# EasyEDA schematic plataforma sensores.json
TITLE: Sheet_1; REV: 1.0; Date: 2023-09-05; Sheet: 1/1; Company: Your Company
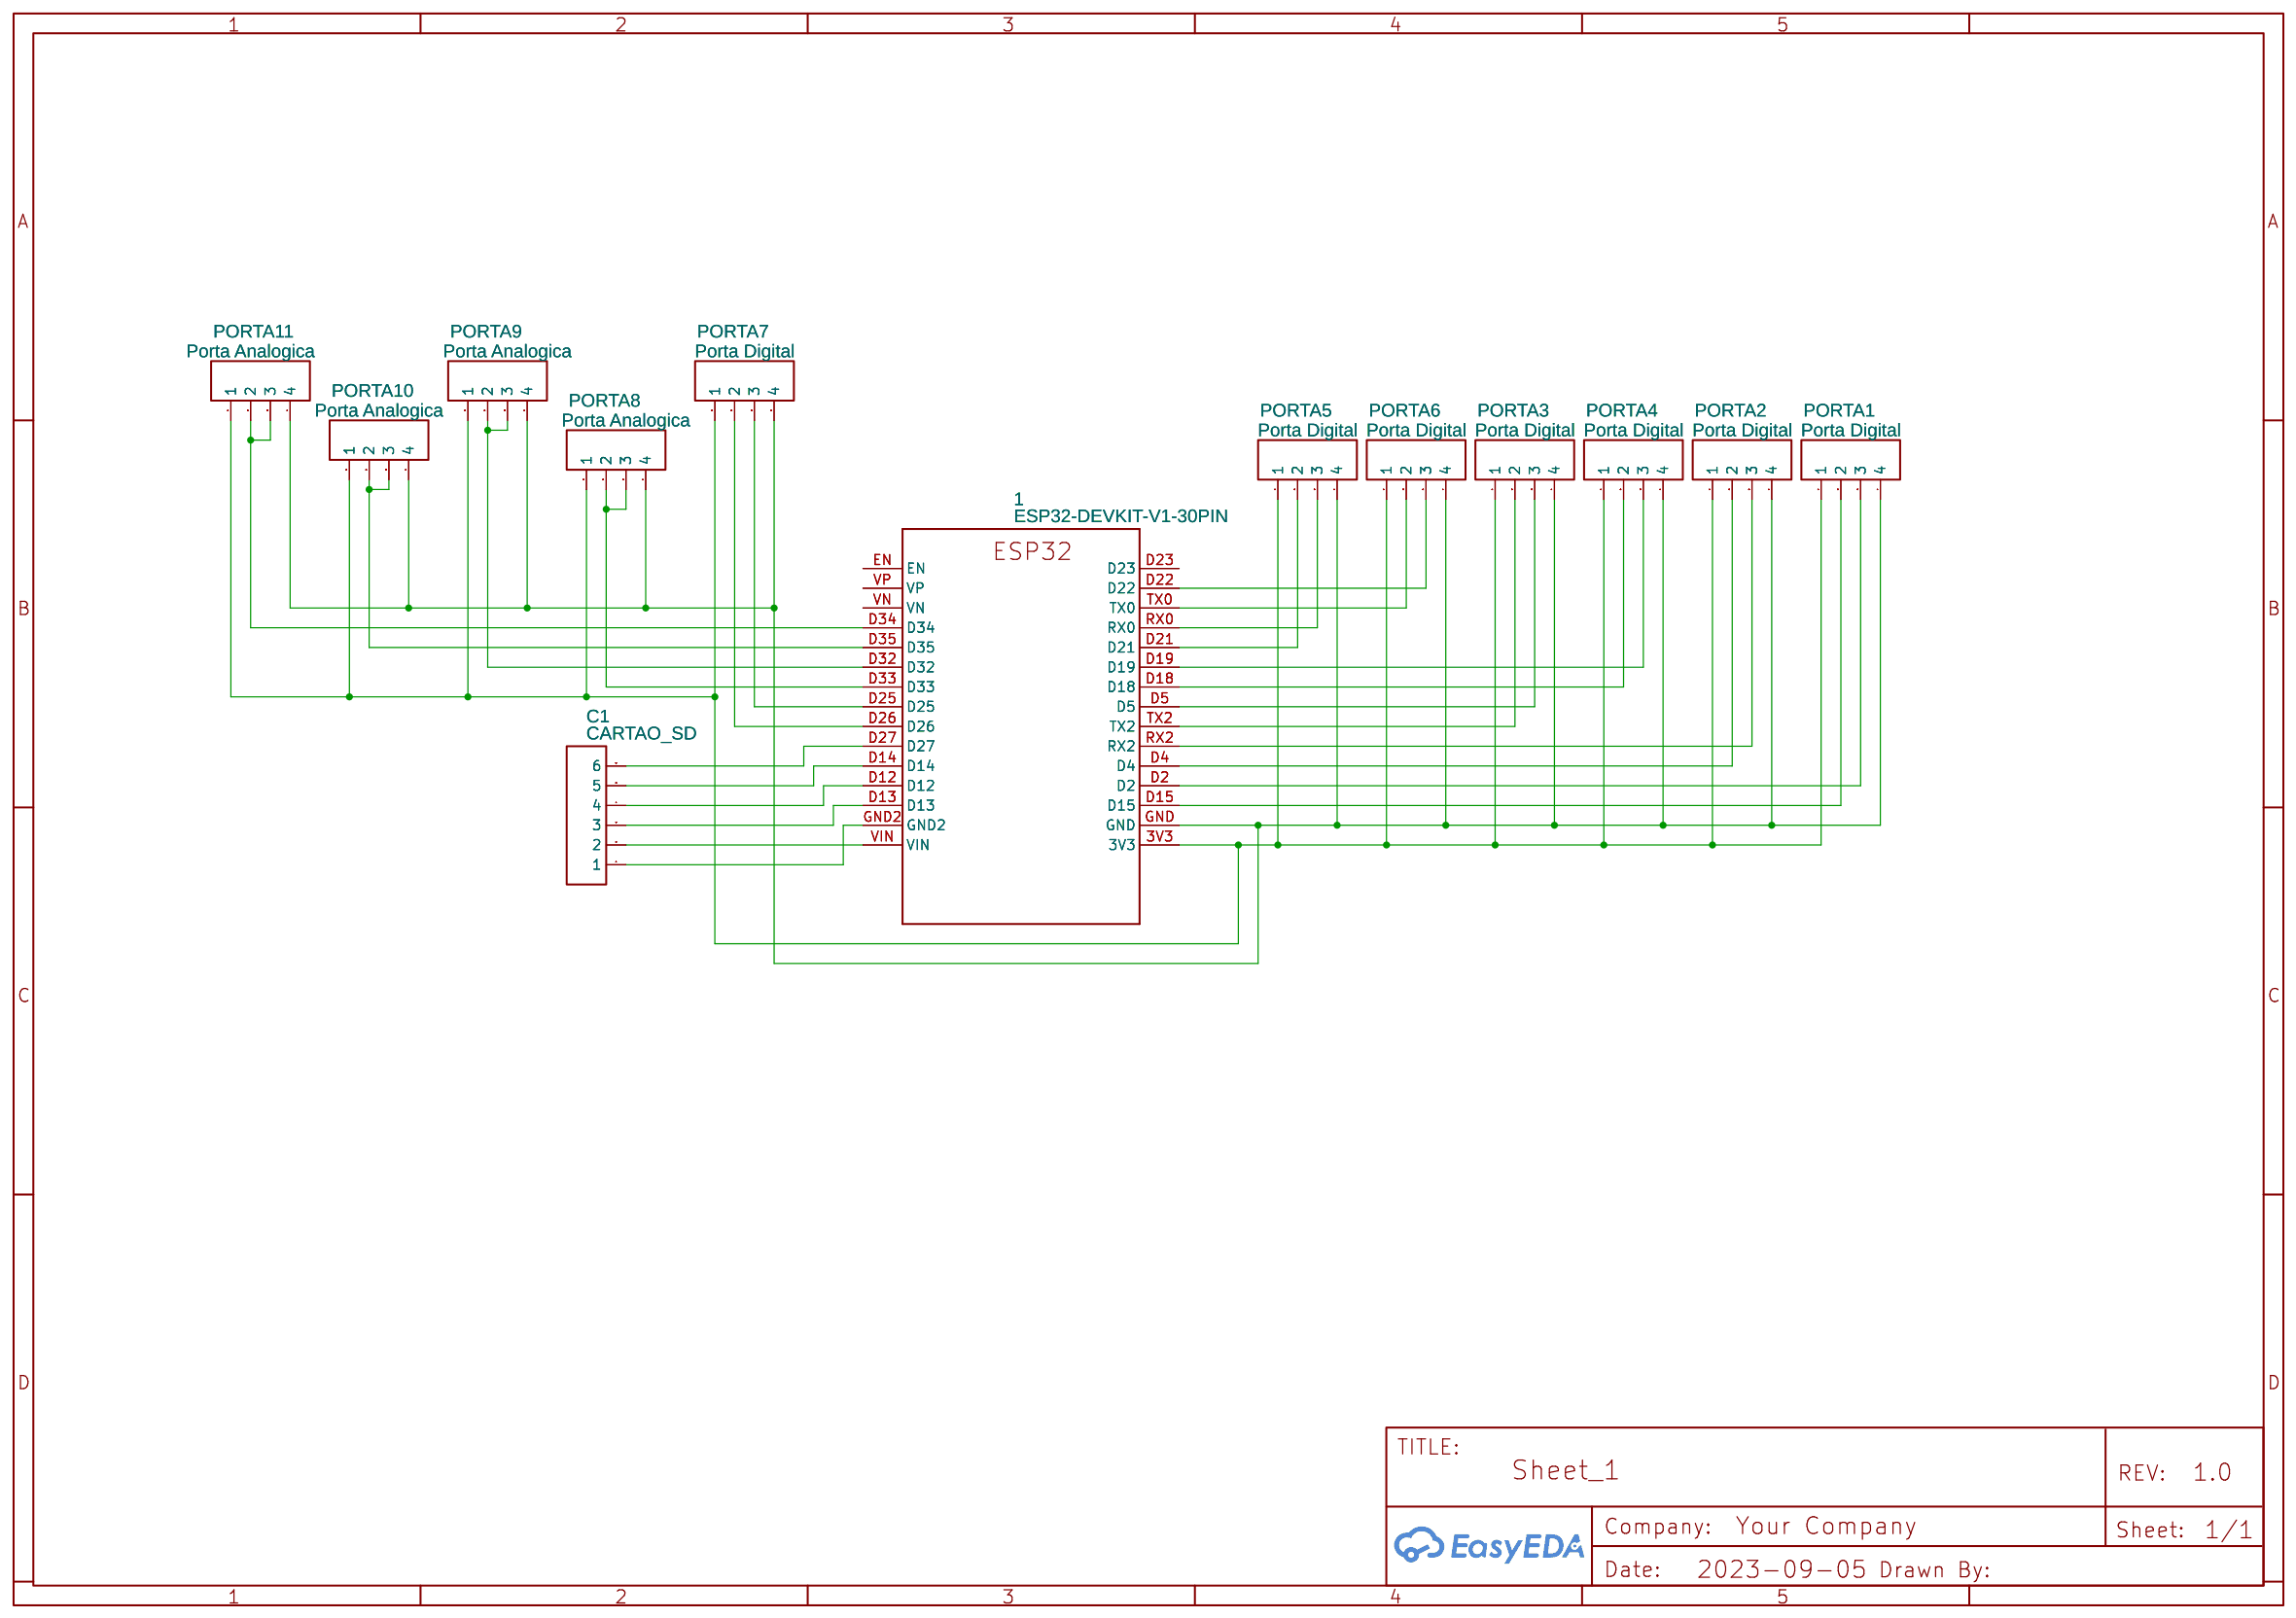
[diagram p0: schematic sheet]

## Parts
1  ESP32-DEVKIT-V1-30PIN  [ESP32-DEVKITV1_ESP32-DEVKITV1]
C1  CARTAO_SD  [HDR-F-2.54_1X6]
PORTA1  Porta Digital  [HDR-F-2.54_1X4]
PORTA2  Porta Digital  [HDR-F-2.54_1X4]
PORTA3  Porta Digital  [HDR-F-2.54_1X4]
PORTA4  Porta Digital  [HDR-F-2.54_1X4]
PORTA5  Porta Digital  [HDR-F-2.54_1X4]
PORTA6  Porta Digital  [HDR-F-2.54_1X4]
PORTA7  Porta Digital  [HDR-F-2.54_1X4]
PORTA8  Porta Analogica  [HDR-F-2.54_1X4]
PORTA9  Porta Analogica  [HDR-F-2.54_1X4]
PORTA10  Porta Analogica  [HDR-F-2.54_1X4]
PORTA11  Porta Analogica  [HDR-F-2.54_1X4]

## Library data of the parts
1 = ESP32-DEVKIT-V1-30PIN: Contributor: KiraKira san
C1 = HDR-F-2.54_1x6: Supplier Part: C40877; Supplier: LCSC; Contributor: LCEDA_Lib
PORTA1-PORTA11 = HDR-F-2.54_1x4: Supplier Part: C225501; Supplier: LCSC; Contributor: LCEDA_Lib

## Nets
Net-(1-3V3): 1.3V3 PORTA1.1 PORTA2.1 PORTA3.1 PORTA4.1 PORTA5.1 PORTA6.1 PORTA7.1 PORTA8.1 PORTA9.1 PORTA10.1 PORTA11.1
Net-(1-D2): 1.D2 PORTA1.3
Net-(1-D4): 1.D4 PORTA2.2
Net-(1-D5): 1.D5 PORTA3.3
Net-(1-D12): 1.D12 C1.4
Net-(1-D13): 1.D13 C1.3
Net-(1-D14): 1.D14 C1.5
Net-(1-D15): 1.D15 PORTA1.2
Net-(1-D18): 1.D18 PORTA4.2
Net-(1-D19): 1.D19 PORTA4.3
Net-(1-D21): 1.D21 PORTA5.2
Net-(1-D22): 1.D22 PORTA6.3
Net-(1-D25): 1.D25 PORTA7.3
Net-(1-D26): 1.D26 PORTA7.2
Net-(1-D27): 1.D27 C1.6
Net-(1-D32): 1.D32 PORTA9.2 PORTA9.3
Net-(1-D33): 1.D33 PORTA8.2 PORTA8.3
Net-(1-D34): 1.D34 PORTA11.2 PORTA11.3
Net-(1-D35): 1.D35 PORTA10.2 PORTA10.3
Net-(1-GND2): 1.GND2 C1.1
Net-(1-GND): 1.GND PORTA1.4 PORTA2.4 PORTA3.4 PORTA4.4 PORTA5.4 PORTA6.4 PORTA7.4 PORTA8.4 PORTA9.4 PORTA10.4 PORTA11.4
Net-(1-RX0): 1.RX0 PORTA5.3
Net-(1-RX2): 1.RX2 PORTA2.3
Net-(1-TX0): 1.TX0 PORTA6.2
Net-(1-TX2): 1.TX2 PORTA3.2
Net-(1-VIN): 1.VIN C1.2

Not connected (* = marked no-connect by the designer): 1 D23 EN VN VP
